# EAGLE design TriggerAndCVs_connectors (EAGLE 9.2.1)
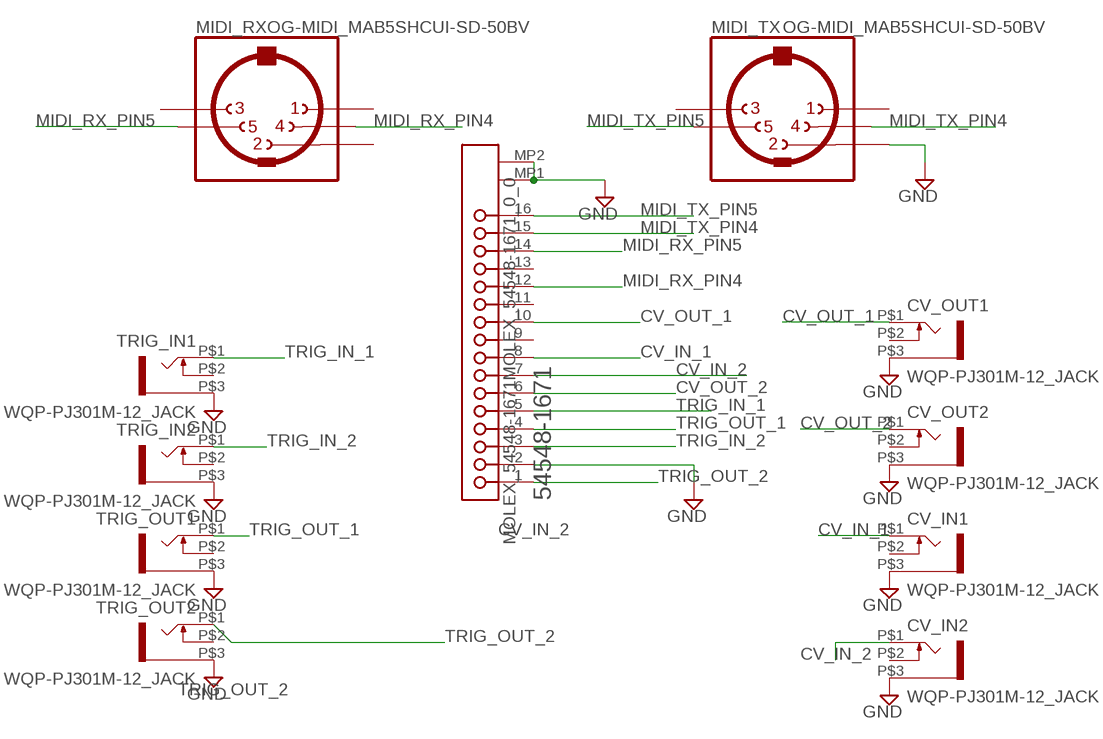
[diagram p0: schematic, sheet 1]

## Parts
CV_IN1  WQP-PJ301M-12_JACK  [WQP-PJ301M-12_JACK]
CV_IN2  WQP-PJ301M-12_JACK  [WQP-PJ301M-12_JACK]
CV_OUT1  WQP-PJ301M-12_JACK  [WQP-PJ301M-12_JACK]
CV_OUT2  WQP-PJ301M-12_JACK  [WQP-PJ301M-12_JACK]
JP4  MOLEX_54548-1671MOLEX_54548-1671_0_0  [MOLEX_54548-1671_0]
MIDI_RX  OG-MIDI_MAB5SHCUI-SD-50BV  [OG-MIDI_SD-50BV]
MIDI_TX  OG-MIDI_MAB5SHCUI-SD-50BV  [OG-MIDI_SD-50BV]
TRIG_IN1  WQP-PJ301M-12_JACK  [WQP-PJ301M-12_JACK]
TRIG_IN2  WQP-PJ301M-12_JACK  [WQP-PJ301M-12_JACK]
TRIG_OUT1  WQP-PJ301M-12_JACK  [WQP-PJ301M-12_JACK]
TRIG_OUT2  WQP-PJ301M-12_JACK  [WQP-PJ301M-12_JACK]

## Nets
CV_IN_1: CV_IN1.P$1 JP4.8
CV_IN_2: CV_IN2.P$1 JP4.7
CV_OUT_1: CV_OUT1.P$1 JP4.10
CV_OUT_2: CV_OUT2.P$1 JP4.6
GND [PWR]: CV_IN1.P$3 CV_IN2.P$3 CV_OUT1.P$3 CV_OUT2.P$3 JP4.2 JP4.MP1 JP4.MP2 MIDI_TX.2 TRIG_IN1.P$3 TRIG_IN2.P$3 TRIG_OUT1.P$3 TRIG_OUT2.P$3
MIDI_RX_PIN4: JP4.12 MIDI_RX.4
MIDI_RX_PIN5: JP4.14 MIDI_RX.5
MIDI_TX_PIN4: JP4.15 MIDI_TX.4
MIDI_TX_PIN5: JP4.16 MIDI_TX.5
TRIG_IN_1: JP4.5 TRIG_IN1.P$1
TRIG_IN_2: JP4.3 TRIG_IN2.P$1
TRIG_OUT_1: JP4.4 TRIG_OUT1.P$1
TRIG_OUT_2: JP4.1 TRIG_OUT2.P$1
Unconnected: CV_IN1.P$2 CV_IN2.P$2 CV_OUT1.P$2 CV_OUT2.P$2 JP4.9 JP4.11 JP4.13 MIDI_RX.1 MIDI_RX.2 MIDI_RX.3 MIDI_TX.1 MIDI_TX.3 TRIG_IN1.P$2 TRIG_IN2.P$2 TRIG_OUT1.P$2 TRIG_OUT2.P$2

## Library data of the parts
CV_IN1 CV_IN2 CV_OUT1 CV_OUT2 TRIG_IN1 TRIG_IN2 TRIG_OUT1 TRIG_OUT2 = thonkiconn:WQP-PJ301M-12_JACK
JP4 = Molex - 54548-1671:MOLEX_54548-1671: MOLX-54548-1671; CIIVA_IDS: 3405222; CIRCUITS_LOADED: 16; COMPONENT_LINK_1_DESCRIPTION: Manufacturer URL; COMPONENT_LINK_1_URL: http://www.molex.com/molex/index.jsp; COMPONENT_LINK_3_DESCRIPTION: Package Specification; COMPONENT_LINK_3_URL: http://www.molex.com/pdm_docs/sd/545481671_sd.pdf; CONTACT_POSITION: Bottom; CURRENT_MAX_PER_CONTACT: 0.5A; DATASHEET: http://www.molex.com/webdocs/datasheets/pdf/en-us/0545481671_FFC_FPC_CONNECTORS.pdf; DURABILITY_MATING_CYCLES_MAX: 20; ENTRY_ANGLE: 90degrees Angle; FOOTPRINT_VARIANT_NAME_0: Manufacturer Recommended; IMPORTED: yes; IMPORTED_FROM: vault; IMPORT_TS: 1521842126; MATED_HEIGHT: 1.20mm; MATERIAL___METAL: Phosphor Bronze; MATERIAL___PLATING_MATING: Gold; MATERIAL___PLATING_TERMINATION: Tin; MF: Molex; MOUNTING_TECHNOLOGY: Surface Mount; MPN: 54548-1671; NUMBER_OF_ROWS: 1; ORIENTATION: Right Angle; PACKAGE: 54548-1671; PACKAGE_DESCRIPTION: 16-Lead FPC Connector, Pitch 0.5 mm; PACKAGE_VERSION: Rev. N, 06/2008; PACKING: Tape and Reel; PCB_LOCATOR: No; PCB_RETENTION: Yes; PITCH___MATING_INTERFACE: 0.50mm; POLARIZED_TO_PCB: Yes; PREFIX: J; RELEASE_DATE: 1411372732; ROHS: Yes; STACKABLE: No; VAULT_GUID: 6073BA2D-1C54-4637-B0CB-3A1C5E03E9B0; VAULT_REVISION: ECAF290E-3206-450B-9A7D-DEE08DAAC15F; VOLTAGE_MAX: 50V
MIDI_RX MIDI_TX = midi-connectors:OG-MIDI_MAB5SH: Female CONNECTOR 5 pins 90 deg. with shield, horizontal (DIN 41524)

## Net classes
1 PWR: width 0.457 mm, clearance 0.203 mm

## Board
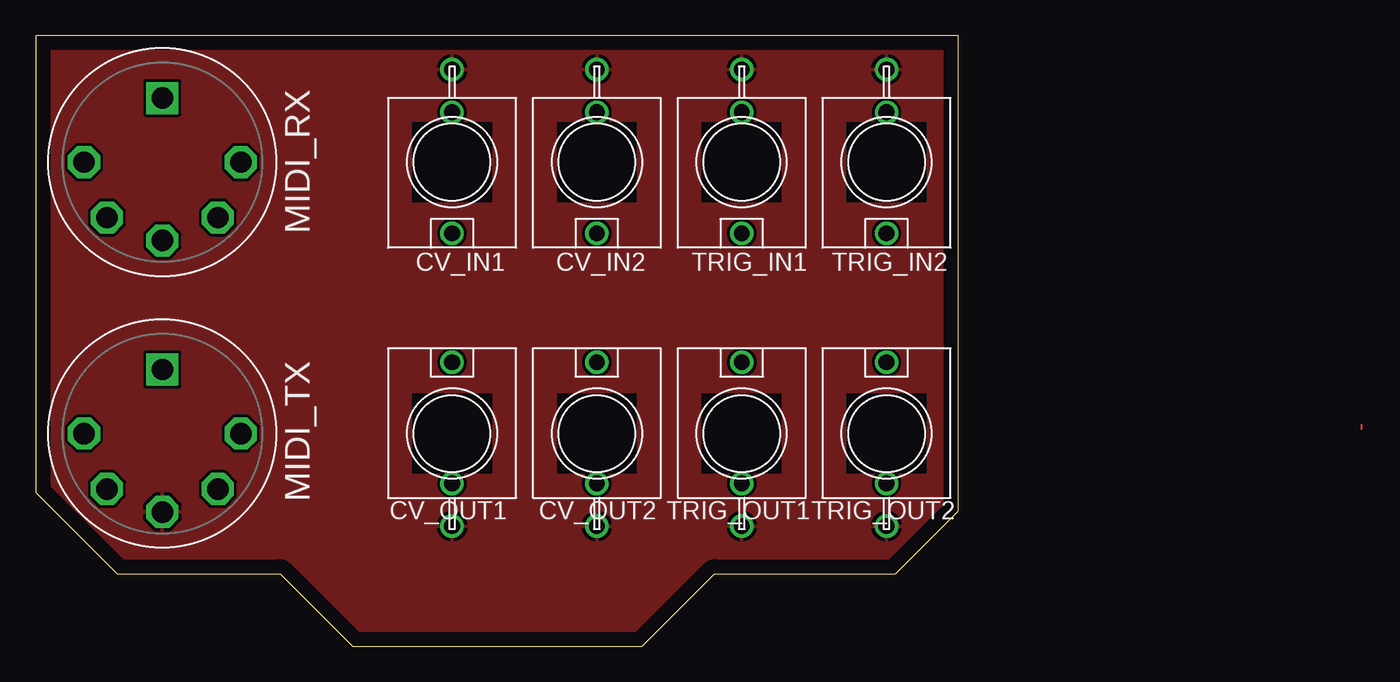
[diagram p1: board, top side]
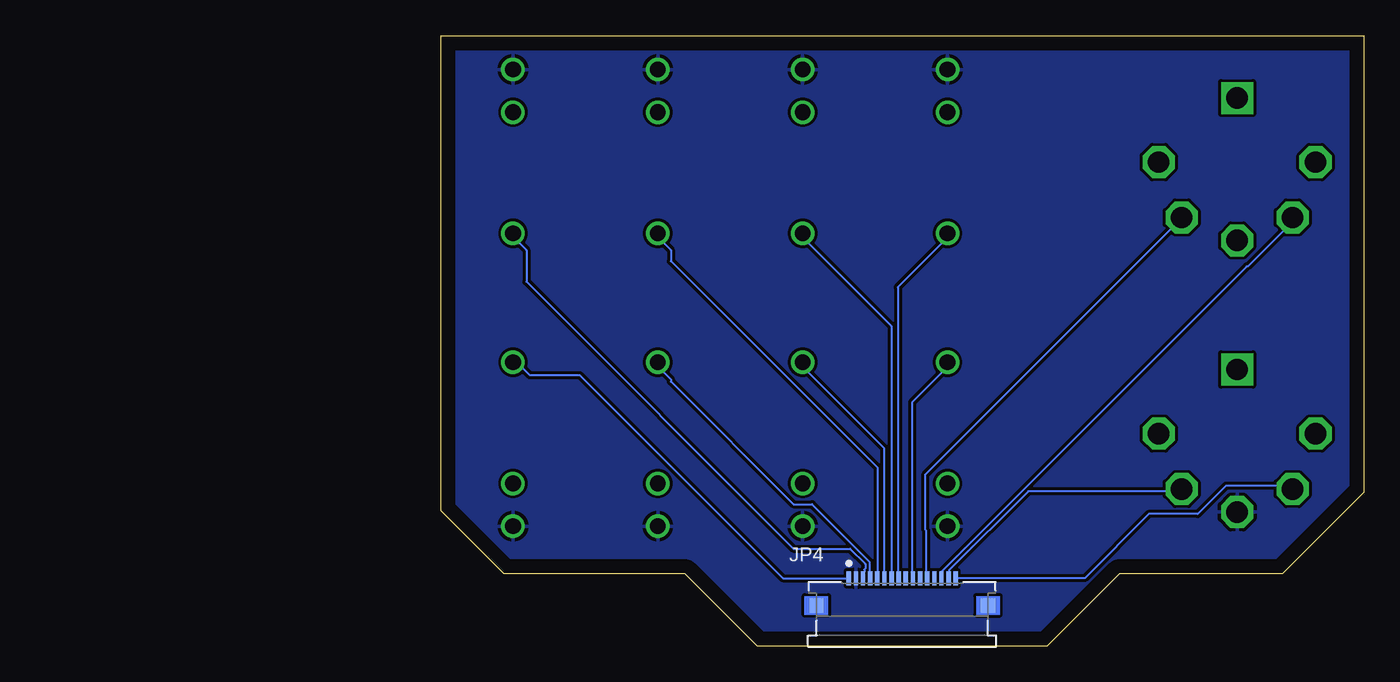
[diagram p2: board, bottom side, seen from below]

Size 64.75 x 42.85 mm. Coordinates in mm from the lower left corner, seen from the top.
Outline: 0,42.85 0,10.79 5.72,5.08 17.15,5.08 22.23,0 42.55,0 47.63,5.08 60.32,5.08 64.75,9.5 64.75,42.85 0,42.85
Copper layers (1*16): Top 0.035mm / dielectric 1.5mm / Bottom 0.035mm
Design rules "default": minimum track width 6mil, minimum drill 0.35mm, track to track 6mil, track to pad 6mil, pad to pad 6mil, via to via 6mil, smd to smd 6mil, copper to edge 40mil, drill to drill 6mil, minimum pad ring 10mil, minimum via ring 8mil, stop-mask expansion 4mil, vias tented up to drill 0mil, thermal gap 10mil

### Footprints (pad centres in the part's own frame; a part is rotated, then mirrored left to right if it is on the bottom)
WQP-PJ301M-12_JACK = drill 1.1: P$1 0,5; P$2 0,-3.5; P$3 0,-6.5
MOLEX_54548-1671_0 = smd 0.3 x 1: 1 -3.75,0.95; 2 -3.25,0.95; 3 -2.75,0.95; 4 -2.25,0.95; 5 -1.75,0.95; 6 -1.25,0.95; 7 -0.75,0.95; 8 -0.25,0.95; 9 0.25,0.95; 10 0.75,0.95; 11 1.25,0.95; 12 1.75,0.95; 13 2.25,0.95; 14 2.75,0.95; 15 3.25,0.95; 16 3.75,0.95 | smd 1 x 1: MP1 -6.025,-0.95; MP2 6.025,-0.95
OG-MIDI_SD-50BV = drill 1.5 octagon: 1 -5.5,0; 2 0,5.5; 3 5.5,0; 4 -3.89,3.89; 5 3.89,3.89 | drill 1.5 square: P$3 0,-4.5

### Placement (x,y rotation side)
CV_IN1  29.21,33.97 180 top
CV_IN2  39.37,33.97 180 top
CV_OUT1  29.21,14.92 0 top
CV_OUT2  39.37,14.92 0 top
JP4  32.38,3.81 0 bottom
MIDI_RX  8.89,33.97 180 top
MIDI_TX  8.89,14.92 180 top
TRIG_IN1  49.53,33.97 180 top
TRIG_IN2  59.69,33.97 180 top
TRIG_OUT1  49.53,14.92 0 top
TRIG_OUT2  59.69,14.92 0 top

### Tracks (layer width: path | path; a pad name or v marks a point on that pad's centre or on a via)
CV_IN_1
  Bottom 0.152: JP4.8 32.69,4.78 32.69,25.2 29.26,28.63 29.26,28.93 CV_IN1.P$1
CV_IN_2
  Bottom 0.152: JP4.7 33.15,4.78 33.15,22.45 39.32,28.63 39.32,28.93 CV_IN2.P$1
CV_OUT_1
  Bottom 0.152: JP4.10 31.7,4.78 31.7,17.12 29.26,19.56 29.26,19.86 CV_OUT1.P$1
CV_OUT_2
  Bottom 0.152: JP4.6 33.68,4.78 33.68,13.92 39.32,19.56 39.32,19.86 CV_OUT2.P$1
GND
  pour Top: -8.25,36.83 -1.9,43.18 -1.9,44.45 64.77,44.45 77.47,31.75 77.47,20.32 55.24,-1.9 7.62,-1.9 -12.06,17.78 -12.06,33.02
  pour Bottom: -12.06,33.02 -0.63,44.45 0.64,44.45 64.77,44.45 77.47,31.75 77.47,20.32 55.24,-1.9 7.62,-1.9 -12.06,17.78
MIDI_RX_PIN4
  Bottom 0.152: JP4.12 30.71,4.78 30.71,8.13 30.79,8.2 30.79,12.01 12.73,30.07 MIDI_RX.4
MIDI_RX_PIN5
  Bottom 0.152: JP4.14 29.64,4.78 29.64,5.23 8.23,26.64 8.15,26.64 5.03,29.77 5.03,30.07 MIDI_RX.5
MIDI_TX_PIN4
  Bottom 0.152: JP4.15 29.11,4.78 29.11,5.31 23.55,10.87 12.95,10.87 12.8,11.02 MIDI_TX.4
MIDI_TX_PIN5
  Bottom 0.152: JP4.16 28.58,4.78 19.58,4.78 15.09,9.27 11.66,9.27 9.68,11.25 5.18,11.25 5.03,11.1 MIDI_TX.5
N$9
  Top 0.152: 93.03,15.24 93.03,15.56
TRIG_IN_1
  Bottom 0.152: TRIG_IN1.P$1 49.53,28.7 48.62,27.79 48.62,27.03 34.14,12.55 34.14,4.78 JP4.5
TRIG_IN_2
  Bottom 0.152: JP4.3 35.13,4.78 35.13,5.16 35.05,5.23 35.05,5.38 34.98,5.46 34.98,5.77 36.04,6.83 40.01,6.83 58.75,25.58 58.75,27.79 59.66,28.7 59.66,28.93 TRIG_IN2.P$1
TRIG_OUT_1
  Bottom 0.152: TRIG_OUT1.P$1 49.53,19.63 48.62,18.72 48.62,18.57 40.01,9.96 38.71,9.96 34.67,5.92 34.67,4.78 JP4.4
TRIG_OUT_2
  Bottom 0.152: JP4.1 36.2,4.78 40.77,4.78 55.02,19.02 58.52,19.02 59.36,19.86 59.66,19.86 TRIG_OUT2.P$1